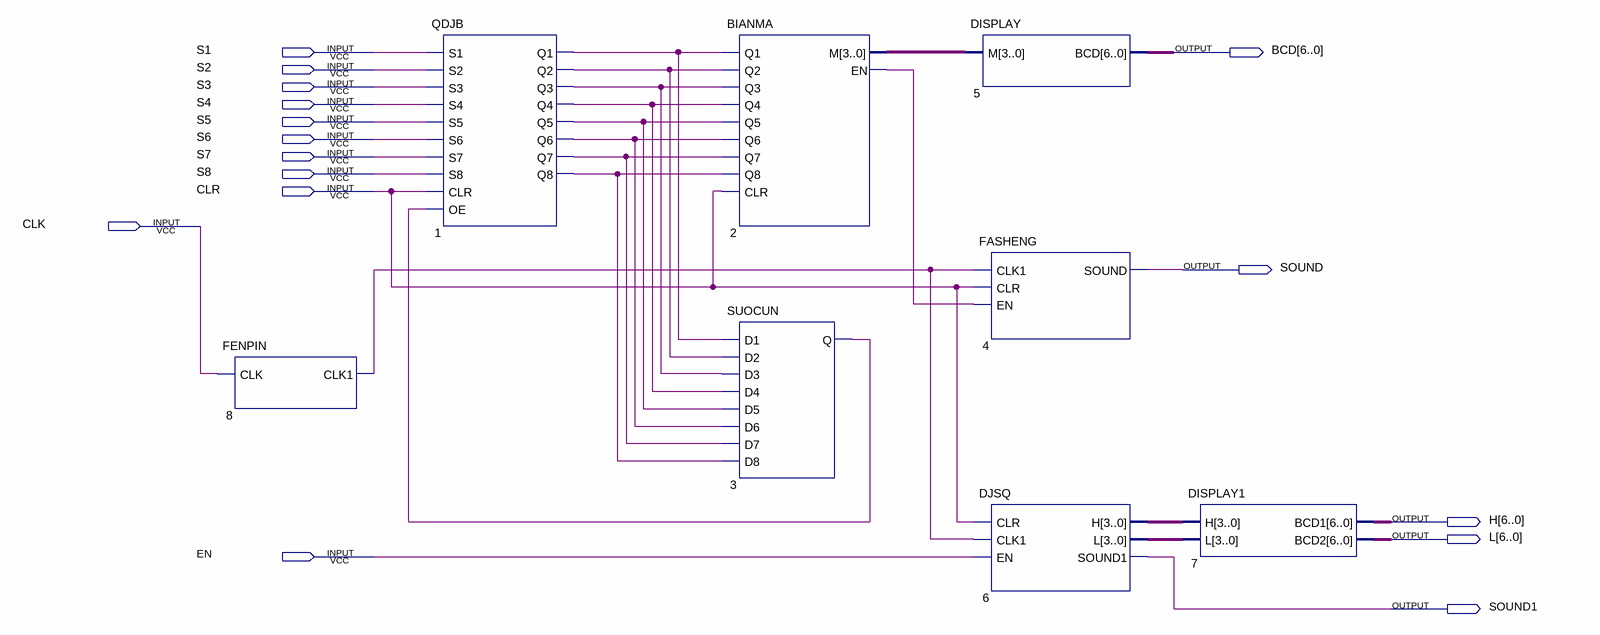
[diagram p0: schematic sheet]
// Quartus schematic QD.bdf as structural Verilog: 8 symbols, 16 pins
module QD (
  input  S1,
  input  S2,
  input  S3,
  input  S4,
  input  S5,
  input  S6,
  input  S7,
  input  S8,
  input  CLR,
  input  CLK,
  input  EN,
  output [6:0] BCD,
  output SOUND,
  output [6:0] H,
  output [6:0] L,
  output SOUND1
);

  wire n1_q1, n1_q2, n1_q3, n1_q4, n1_q5, n1_q6, n1_q7, n1_q8, n2_en, n3_q, n8_clk1;
  wire [3:0] n2_m, n6_h, n6_l;

  FENPIN u_8 (.CLK(CLK), .CLK1(n8_clk1));
  QDJB u_1 (
    .S1(S1), .S2(S2), .S3(S3), .S4(S4), .S5(S5), .S6(S6), .S7(S7), .S8(S8), .CLR(CLR), .OE(n3_q), .Q1(n1_q1),
    .Q2(n1_q2), .Q3(n1_q3), .Q4(n1_q4), .Q5(n1_q5), .Q6(n1_q6), .Q7(n1_q7), .Q8(n1_q8));
  BIANMA u_2 (
    .Q1(n1_q1), .Q2(n1_q2), .Q3(n1_q3), .Q4(n1_q4), .Q5(n1_q5), .Q6(n1_q6), .Q7(n1_q7), .Q8(n1_q8),
    .CLR(CLR), .M(n2_m), .EN(n2_en));
  SUOCUN u_3 (.D1(n1_q1), .D2(n1_q2), .D3(n1_q3), .D4(n1_q4), .D5(n1_q5), .D6(n1_q6), .D7(n1_q7), .D8(n1_q8), .Q(n3_q));
  DISPLAY u_5 (.M(n2_m), .BCD(BCD));
  FASHENG u_4 (.CLK1(n8_clk1), .CLR(CLR), .EN(n2_en), .SOUND(SOUND));
  DJSQ u_6 (.CLR(CLR), .CLK1(n8_clk1), .EN(EN), .H(n6_h), .L(n6_l), .SOUND1(SOUND1));
  DISPLAY1 u_7 (.H(n6_h), .L(n6_l), .BCD1(H), .BCD2(L));
endmodule
